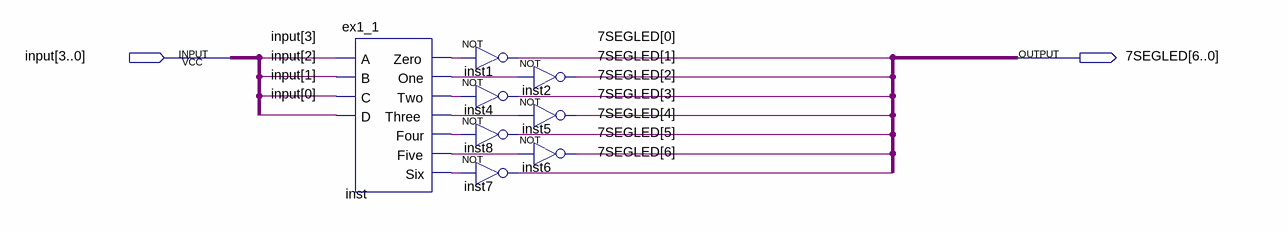
[diagram p0: schematic sheet]
// Quartus schematic 7SEGLED.bdf as structural Verilog: 8 symbols, 2 pins
module \7SEGLED  (
  input  [3:0] \input ,
  output [6:0] \7SEGLED 
);

  wire inst_five, inst_four, inst_one, inst_six, inst_three, inst_two, inst_zero;

  ex1_1 inst (
    .A(\input [3]), .B(\input [2]), .C(\input [1]), .D(\input [0]), .Zero(inst_zero), .One(inst_one),
    .Two(inst_two), .Three(inst_three), .Four(inst_four), .Five(inst_five), .Six(inst_six));
  not inst1 (\7SEGLED [0], inst_zero);
  not inst2 (\7SEGLED [1], inst_one);
  not inst4 (\7SEGLED [2], inst_two);
  not inst5 (\7SEGLED [3], inst_three);
  not inst8 (\7SEGLED [4], inst_four);
  not inst6 (\7SEGLED [5], inst_five);
  not inst7 (\7SEGLED [6], inst_six);
endmodule
